# EAGLE design M652A (EAGLE 6.6.0)
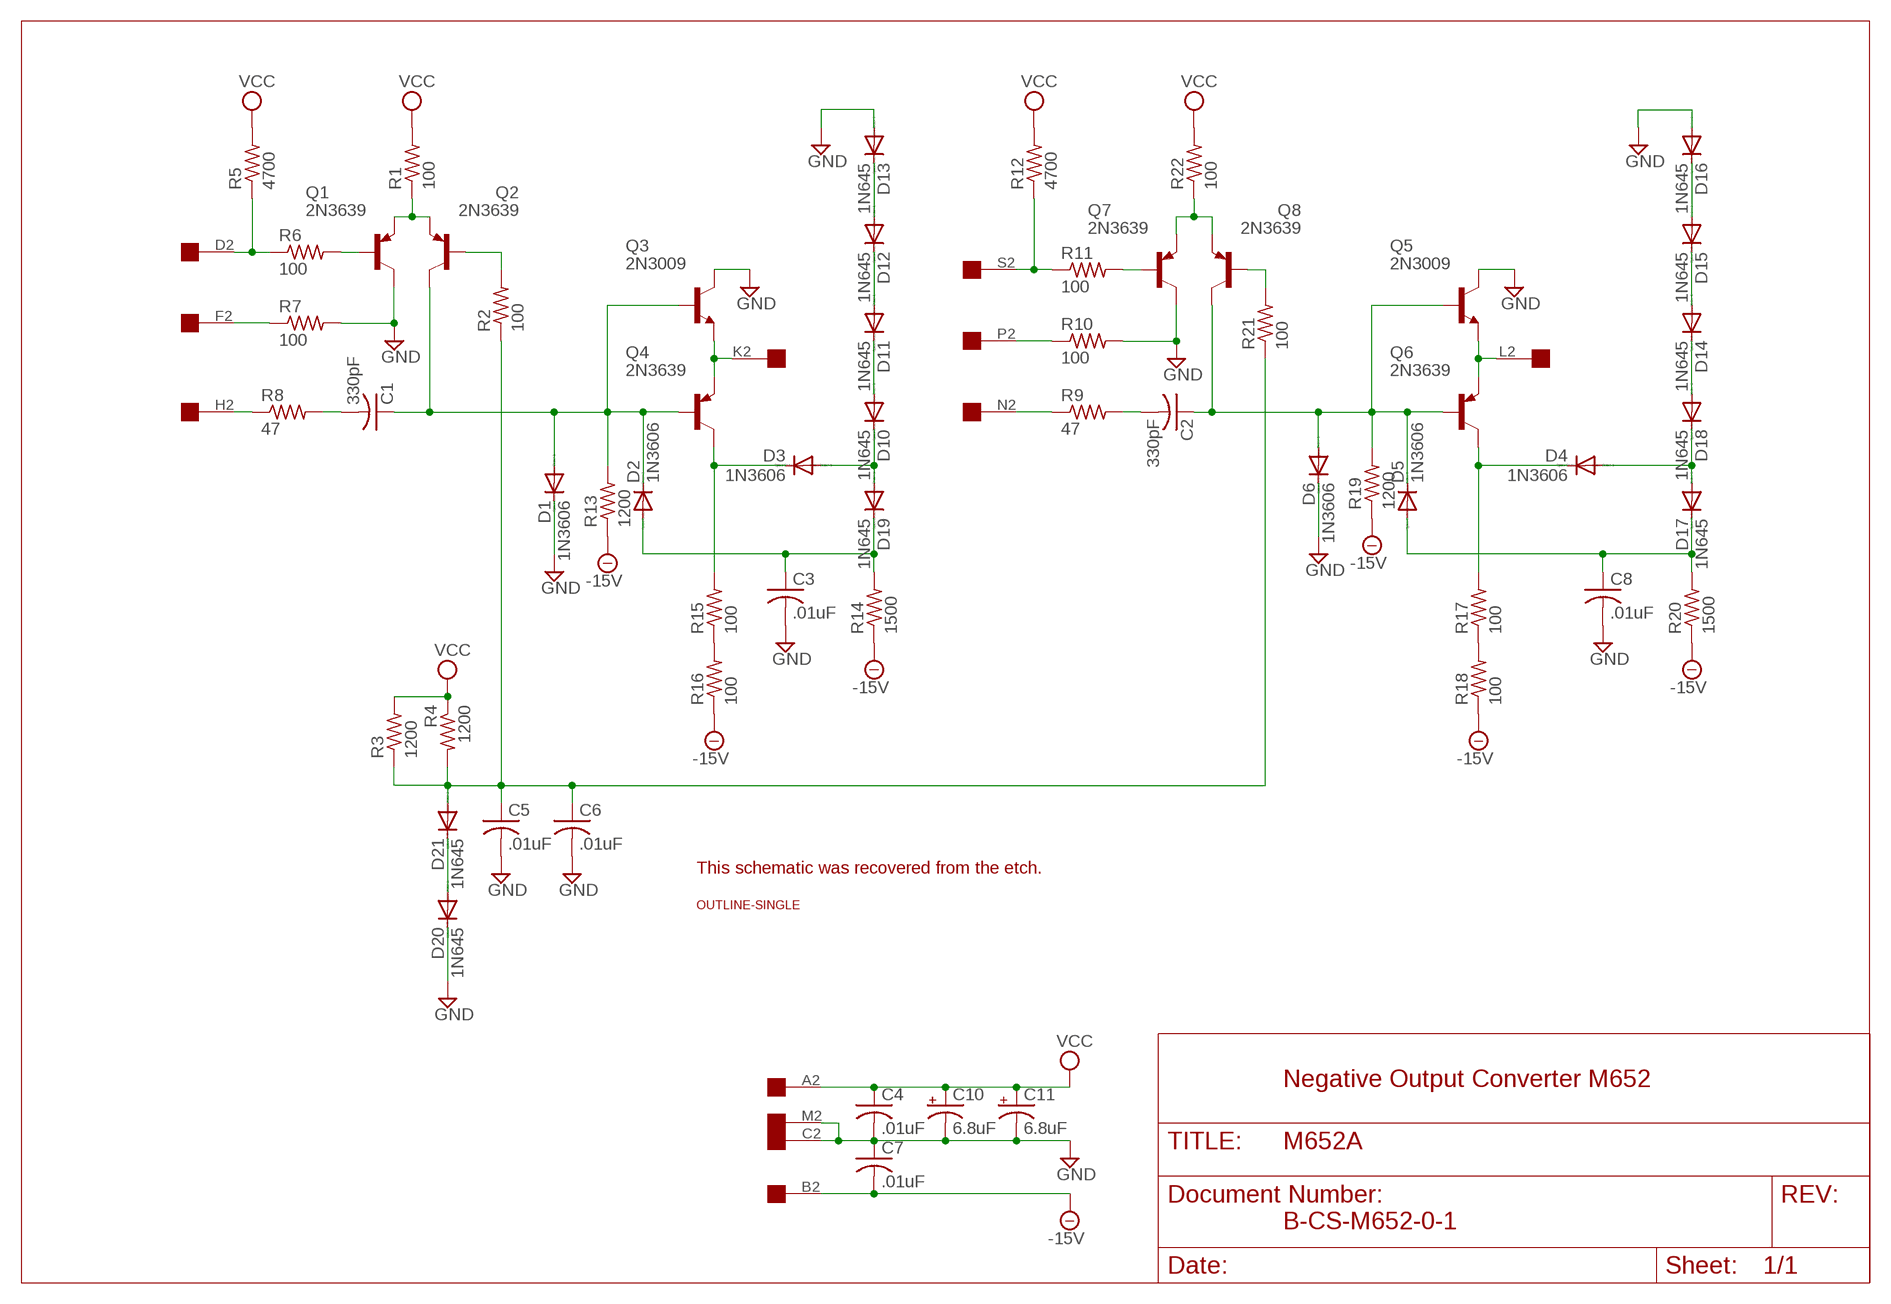
[diagram p0: schematic, sheet 1]

## Parts
C1  330pF  C-US150-054X183  [C150-054X183]
C2  330pF  C-US150-054X183  [C150-054X183]
C3  .01uF  C-US050-025X075  [C050-025X075]
C4  .01uF  C-US050-025X075  [C050-025X075]
C5  .01uF  C-US050-025X075  [C050-025X075]
C6  .01uF  C-US050-025X075  [C050-025X075]
C7  .01uF  C-US050-025X075  [C050-025X075]
C8  .01uF  C-US050-025X075  [C050-025X075]
C10  6.8uF  CPOL-USE12-4AXIAL  [E12-4]
C11  6.8uF  CPOL-USE12-4AXIAL  [E12-4]
D1  1N3606  1N4148DO35-10  [DO35-10]
D2  1N3606  1N4148DO35-10  [DO35-10]
D3  1N3606  1N4148DO35-10  [DO35-10]
D4  1N3606  1N4148DO35-10  [DO35-10]
D5  1N3606  1N4148DO35-10  [DO35-10]
D6  1N3606  1N4148DO35-10  [DO35-10]
D10  1N645  1N4148DO35-10  [DO35-10]
D11  1N645  1N4148DO35-10  [DO35-10]
D12  1N645  1N4148DO35-10  [DO35-10]
D13  1N645  1N4148DO35-10  [DO35-10]
D14  1N645  1N4148DO35-10  [DO35-10]
D15  1N645  1N4148DO35-10  [DO35-10]
D16  1N645  1N4148DO35-10  [DO35-10]
D17  1N645  1N4148DO35-10  [DO35-10]
D18  1N645  1N4148DO35-10  [DO35-10]
D19  1N645  1N4148DO35-10  [DO35-10]
D20  1N645  1N4148DO35-10  [DO35-10]
D21  1N645  1N4148DO35-10  [DO35-10]
Q1  2N3639  2N5415  [TO39]
Q2  2N3639  2N5415  [TO39]
Q3  2N3009  2N2219  [TO5]
Q4  2N3639  2N5415  [TO39]
Q5  2N3009  2N2219  [TO5]
Q6  2N3639  2N5415  [TO39]
Q7  2N3639  2N5415  [TO39]
Q8  2N3639  2N5415  [TO39]
R1  100  R-US_0207/10  [0207/10]
R2  100  R-US_0207/10  [0207/10]
R3  1200  R-US_0207/10  [0207/10]
R4  1200  R-US_0207/10  [0207/10]
R5  4700  R-US_0207/10  [0207/10]
R6  100  R-US_0207/10  [0207/10]
R7  100  R-US_0207/10  [0207/10]
R8  47  R-US_0207/10  [0207/10]
R9  47  R-US_0207/10  [0207/10]
R10  100  R-US_0207/10  [0207/10]
R11  100  R-US_0207/10  [0207/10]
R12  4700  R-US_0207/10  [0207/10]
R13  1200  R-US_0207/10  [0207/10]
R14  1500  R-US_0207/10  [0207/10]
R15  100  R-US_0207/10  [0207/10]
R16  100  R-US_0207/10  [0207/10]
R17  100  R-US_0207/10  [0207/10]
R18  100  R-US_0207/10  [0207/10]
R19  1200  R-US_0207/10  [0207/10]
R20  1500  R-US_0207/10  [0207/10]
R21  100  R-US_0207/10  [0207/10]
R22  100  R-US_0207/10  [0207/10]
U$1  OUTLINE-SINGLE  [SINGLE]
U$3  EDGE-1  [EDGE-CON1]

## Nets
-15V: C7.2 R13.1 R14.1 R16.1 R18.1 R19.1 R20.1 U$3.B2
GND [Supply]: C3.2 C4.2 C5.2 C6.2 C7.1 C8.2 C10.- C11.- D1.C D6.C D13.A D16.A D20.C Q1.3(C) Q3.3(C) Q5.3(C) Q7.3(C) R7.2 R10.2 U$3.C2 U$3.M2
N$1: R5.1 R6.1 U$3.D2
N$2: Q1.2(B) R6.2
N$3: Q1.1(E) Q2.1(E) R1.1
N$4: R7.1 U$3.F2
N$5: R8.1 U$3.H2
N$6: C1.2 R8.2
N$7: R15.1 R16.2
N$8: Q3.1(E) Q4.1(E) U$3.K2
N$9: Q5.1(E) Q6.1(E) U$3.L2
N$10: C2.1 D5.C D6.A Q5.2(B) Q6.2(B) Q8.3(C) R19.2
N$11: C1.1 D1.A D2.C Q2.3(C) Q3.2(B) Q4.2(B) R13.2
N$12: Q7.1(E) Q8.1(E) R22.1
N$13: Q7.2(B) R11.2
N$14: R11.1 R12.1 U$3.S2
N$15: R9.1 U$3.N2
N$16: R10.1 U$3.P2
N$17: C5.1 C6.1 D21.A R2.1 R3.1 R4.2 R21.1
N$18: C2.2 R9.2
N$19: D12.A D13.C
N$20: D15.A D16.C
N$21: D11.A D12.C
N$22: D14.A D15.C
N$23: D10.A D11.C
N$24: D14.C D18.A
N$25: C3.1 D2.A D19.C R14.2
N$26: D3.A D10.C D19.A
N$27: D4.A D17.A D18.C
N$28: C8.1 D5.A D17.C R20.2
N$30: D3.C Q4.3(C) R15.2
N$31: D20.A D21.C
N$32: Q2.2(B) R2.2
N$34: Q8.2(B) R21.2
N$36: R17.1 R18.2
N$37: D4.C Q6.3(C) R17.2
VCC [Supply]: C4.1 C10.+ C11.+ R1.2 R3.2 R4.1 R5.2 R12.2 R22.2 U$3.A2
Unconnected: U$3.E2 U$3.J2 U$3.R2 U$3.T2 U$3.U2 U$3.V2

## Notes on the sheet
- This schematic was recovered from the etch.
- Negative Output Converter M652
- B-CS-M652-0-1

## Library data of the parts
C1-C8 = rcl:C-US: CAPACITOR, American symbol
C10 C11 = dec-con:CPOL-USE12-4AXIAL: 0.5" veresion of an electrolytic
D1-D6 D10-D21 = diode:1N4148: DIODE high speed (Philips)
Q1 Q2 Q4 Q6-Q8 = transistor-pnp:2N5415*: PNP Transistror
Q3 Q5 = transistor-npn:2N2219: NPN Transistor
R1-R22 = rcl:R-US_: RESISTOR, American symbol
U$1 = dec-con:OUTLINE-*: Board outlines for DEC boards.
U$3 = dec-con:EDGE-1: Single-Sided DEC Edge Connector -- (side 2)

## Net classes
1 Supply: width 0.813 mm

## Board
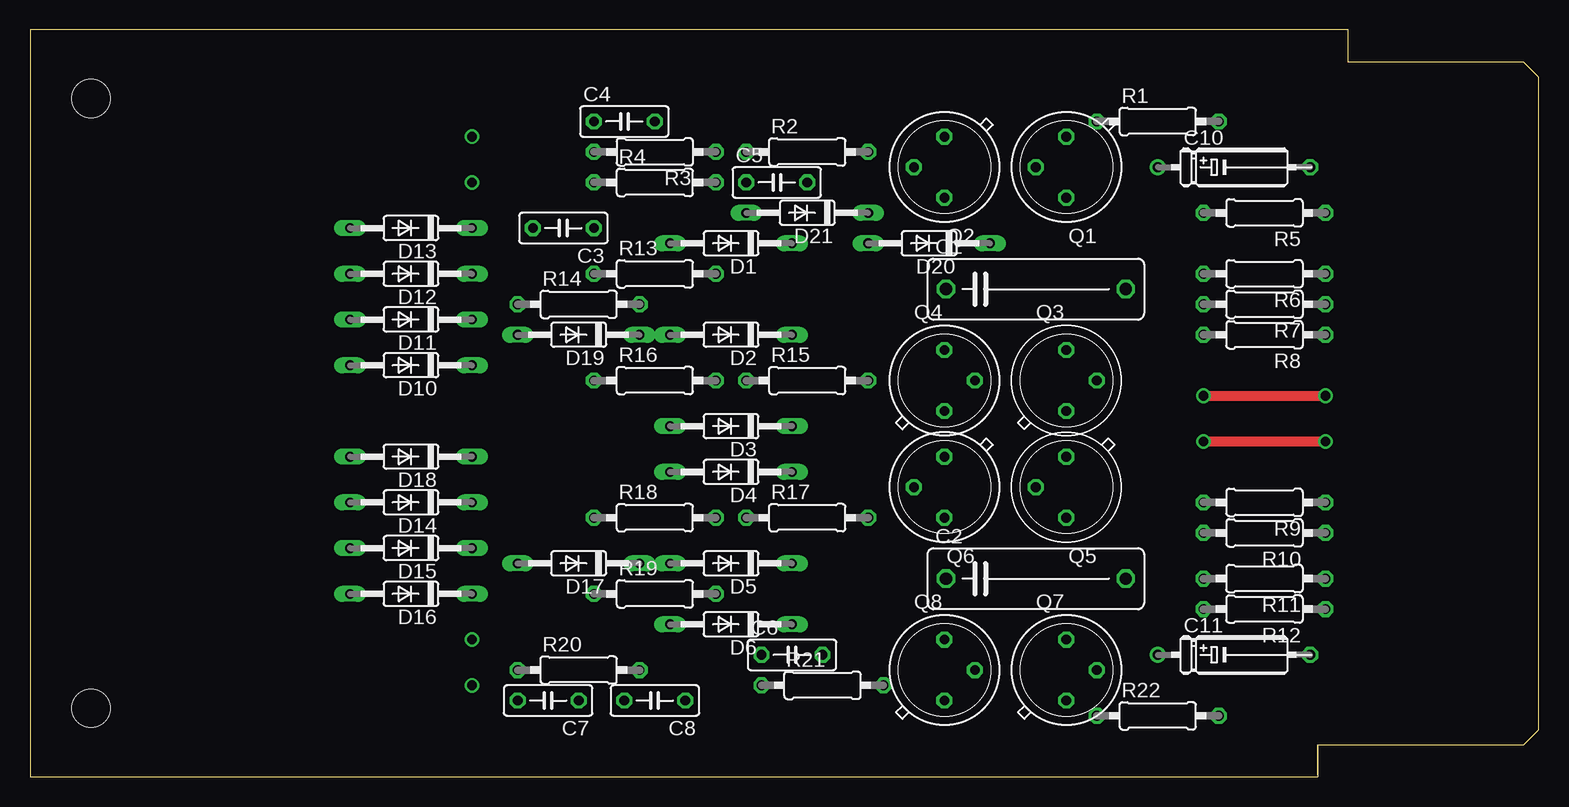
[diagram p1: board, top side]
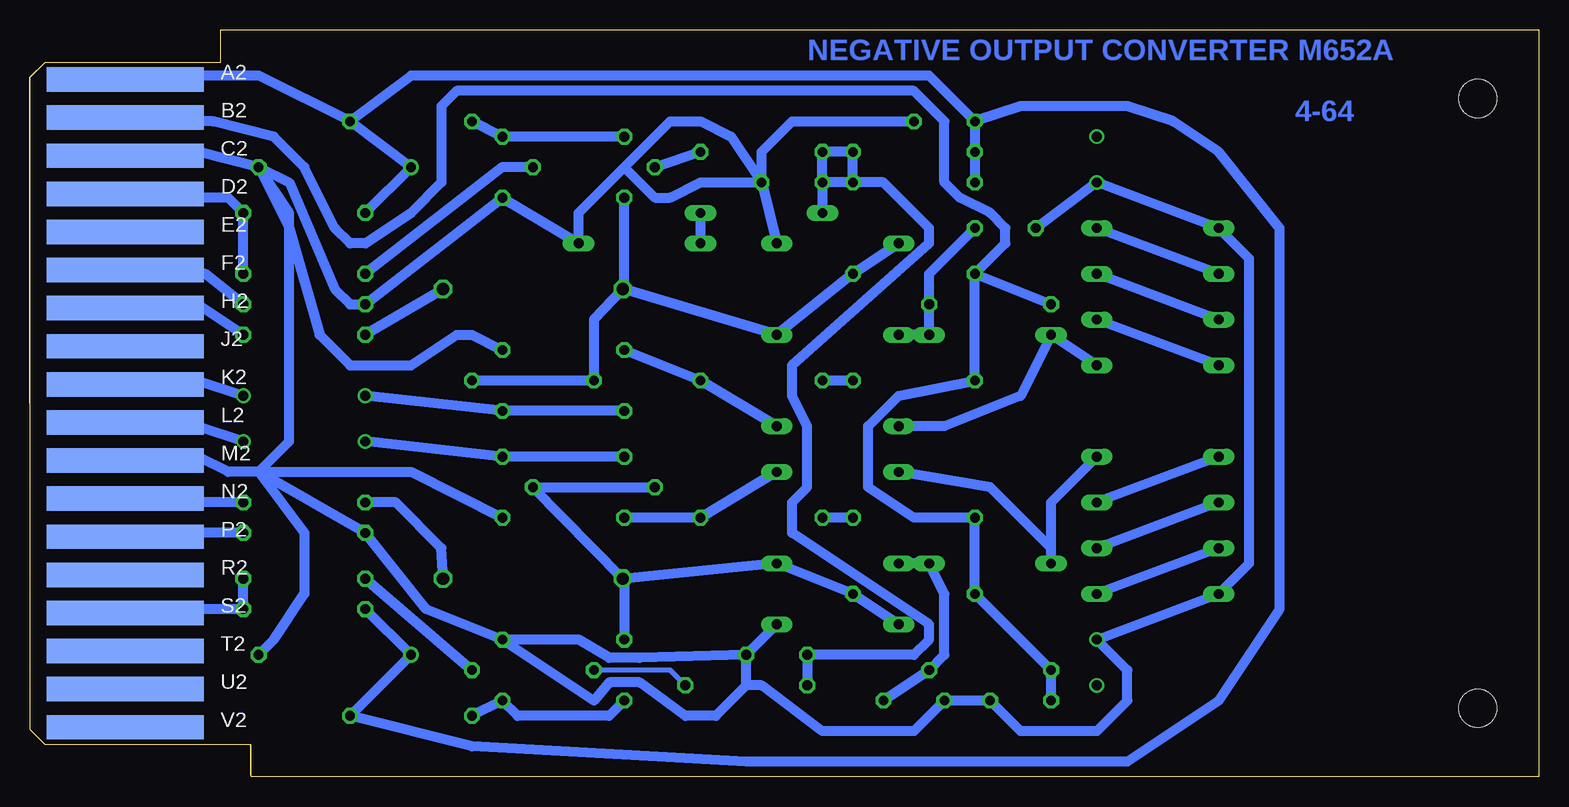
[diagram p2: board, bottom side, seen from below]

Size 125.73 x 62.23 mm. Coordinates in mm from the lower left corner, seen from the top.
Copper layers (1+16): Top 0.035mm / dielectric 1.5mm / Bottom 0.035mm
Design rules "16mils": minimum track width 16mil, minimum drill 32mil, track to track 15mil, track to pad 10mil, pad to pad 10mil, via to via 10mil, smd to smd 10mil, copper to edge 13mil, drill to drill 10mil, minimum pad ring 10mil, minimum via ring 8mil, stop-mask expansion 0mil, vias tented up to drill 0mil, thermal gap 10mil

### Footprints (pad centres in the part's own frame; a part is rotated, then mirrored left to right if it is on the bottom)
C150-054X183 = drill 1.016 octagon: 1 -7.493,0; 2 7.493,0
C050-025X075 = drill 0.813 octagon: 1 -2.54,0; 2 2.54,0
E12-4 = drill 0.813: + -7.62,0 | drill 0.813 octagon: - 5.08,0
DO35-10 = drill 0.813 long: A 5.08,0; C -5.08,0
TO39 = drill 0.813 octagon: 1 0,-2.54; 2 2.54,0; 3 0,2.54
TO5 = drill 0.813 octagon: 1 0,-2.54; 2 2.54,0; 3 0,2.54
0207/10 = drill 0.813 octagon: 1 -5.08,0; 2 5.08,0
SINGLE = hole 3.175: 120.65,56.515; 120.65,5.715
EDGE-CON1 = smd 13.106 x 2.032 bottom: A2 7.938,4.128; B2 7.938,7.303; C2 7.938,10.477; D2 7.938,13.652; E2 7.938,16.828; F2 7.938,20.003; H2 7.938,23.177; J2 7.938,26.352; K2 7.938,29.527; L2 7.938,32.703; M2 7.938,35.877; N2 7.938,39.053; P2 7.938,42.227; R2 7.938,45.403; S2 7.938,48.578; T2 7.938,51.752; U2 7.938,54.928; V2 7.938,58.102

### Placement (x,y rotation side)
C1  83.82,40.64 0 top
C2  83.82,16.51 0 top
C3  44.45,45.72 180 top
C4  49.53,54.61 0 top
C5  62.23,49.53 0 top
C6  63.5,10.16 0 top
C7  43.18,6.35 180 top
C8  52.07,6.35 180 top
C10  101.6,50.8 0 top
C11  101.6,10.16 0 top
D1  58.42,44.45 180 top
D2  58.42,36.83 180 top
D3  58.42,29.21 180 top
D4  58.42,25.4 180 top
D5  58.42,17.78 180 top
D6  58.42,12.7 180 top
D10  31.75,34.29 180 top
D11  31.75,38.1 180 top
D12  31.75,41.91 180 top
D13  31.75,45.72 180 top
D14  31.75,22.86 180 top
D15  31.75,19.05 180 top
D16  31.75,15.24 180 top
D17  45.72,17.78 180 top
D18  31.75,26.67 180 top
D19  45.72,36.83 180 top
D20  74.93,44.45 180 top
D21  64.77,46.99 180 top
Q1  86.36,50.8 180 top
Q2  76.2,50.8 180 top
Q3  86.36,33.02 0 top
Q4  76.2,33.02 0 top
Q5  86.36,24.13 180 top
Q6  76.2,24.13 180 top
Q7  86.36,8.89 0 top
Q8  76.2,8.89 0 top
R1  93.98,54.61 0 top
R2  64.77,52.07 0 top
R3  52.07,52.07 180 top
R4  52.07,49.53 0 top
R5  102.87,46.99 180 top
R6  102.87,41.91 180 top
R7  102.87,39.37 180 top
R8  102.87,36.83 180 top
R9  102.87,22.86 180 top
R10  102.87,20.32 180 top
R11  102.87,16.51 180 top
R12  102.87,13.97 180 top
R13  52.07,41.91 0 top
R14  45.72,39.37 0 top
R15  64.77,33.02 0 top
R16  52.07,33.02 0 top
R17  64.77,21.59 0 top
R18  52.07,21.59 0 top
R19  52.07,15.24 0 top
R20  45.72,8.89 0 top
R21  66.04,7.62 0 top
R22  93.98,5.08 0 top
U$1  125.73,62.23 180 top
U$3  125.73,62.23 180 top

### Tracks (layer width: path | path; a pad name or v marks a point on that pad's centre or on a via)
-15V
  Bottom 0.813: U$3.B2 116.84,54.61 110.49,54.61 105.41,53.34 102.87,50.8 100.33,45.72 99.06,44.45 97.79,44.45 93.98,46.99 91.44,49.53 91.44,55.88 90.17,57.15 52.07,57.15 49.53,54.61 49.53,49.53 48.26,48.26 45.72,46.99 44.45,45.72 44.45,44.45 R13.1 | R13.1 R14.1 | R13.1 R16.1 53.34,31.75 55.88,29.21 55.88,24.13 52.07,21.59 R18.1 R19.1 R20.1 C7.2
GND  (via drill 0.81)
  Bottom 0.813: U$3.C2 116.84,52.07 111.76,52.07 C10.- | C10.- 104.14,49.53 100.33,40.64 99.06,39.37 R7.2 Q1.3 D20.C 80.01,46.99 76.2,50.8 | Q3.3 88.9,36.83 90.17,36.83 93.98,34.29 99.06,34.29 101.6,36.83 104.14,45.72 C10.- | U$3.M2 116.84,26.67 111.76,26.67 109.22,25.4 106.68,25.4 | 106.68,25.4 104.14,27.94 104.14,46.99 C10.- | Q5.3 93.98,25.4 106.68,25.4 | C11.- 105.41,11.43 102.87,15.24 102.87,20.32 106.68,25.4 | C4.2 62.23,54.61 64.77,52.07 C5.2 | C5.2 69.85,49.53 72.39,48.26 73.66,48.26 76.2,50.8 | C5.2 67.31,53.34 69.85,54.61 72.39,54.61 76.2,50.8 | 106.68,25.4 R10.2 92.71,13.97 Q7.3 | C3.2 v36.83,49.53 D13.A 24.13,43.18 24.13,17.78 D16.A v36.83,11.43 34.29,8.89 34.29,6.35 36.83,3.81 43.18,3.81 C7.1 C8.2 52.07,3.81 59.69,3.81 64.77,7.62 66.04,7.62 | Q7.3 78.74,6.35 77.47,7.87 74.93,7.87 71.12,5.08 68.58,5.08 66.04,7.62 | 66.04,7.62 C6.2 | C5.2 D1.C | C6.2 74.93,9.91 77.47,9.91 80.01,11.43 Q7.3 | C6.2 D6.C
N$1
  Bottom 0.813: U$3.D2 116.84,48.26 109.22,48.26 R5.1 R6.1
N$2
  Bottom 0.813: Q1.2 86.36,50.8 R6.2
N$3
  Bottom 0.813: Q2.1 Q1.1 R1.1
N$4
  Bottom 0.813: U$3.F2 116.84,41.91 111.12,41.91 R7.1
N$5
  Bottom 0.813: U$3.H2 116.84,39.37 111.76,39.37 R8.1
N$6
  Bottom 0.813: C1.2 R8.2
N$7
  Bottom 0.813: R16.2 R15.1
N$8  (via drill 0.81)
  Top 0.813: v97.79,31.75 v107.95,31.75
  Bottom 0.813: U$3.K2 116.84,33.02 111.76,33.02 v107.95,31.75 | v97.79,31.75 Q3.1 Q4.1
N$9  (via drill 0.81)
  Top 0.813: v97.79,27.94 v107.95,27.94
  Bottom 0.813: Q6.1 Q5.1 v97.79,27.94 | U$3.L2 116.84,29.21 111.76,29.21 v107.95,27.94
N$10
  Bottom 0.813: Q6.2 Q5.2 C2.1 76.2,16.51 | 76.2,16.51 Q8.3 | 76.2,16.51 D5.C R19.2 D6.A
N$11
  Bottom 0.813: Q3.2 Q4.2 78.74,38.1 C1.1 76.21,40.6 | 76.21,40.6 D2.C R13.2 D1.A | 76.21,40.6 76.2,40.64 Q2.3
N$12
  Bottom 0.813: Q8.1 77.47,5.08 85.09,5.08 Q7.1 R22.1
N$13
  Bottom 0.813: Q7.2 R11.2
N$14
  Bottom 0.813: U$3.S2 116.84,13.97 R12.1 R11.1
N$15
  Bottom 0.813: U$3.N2 116.84,22.86 R9.1
N$16
  Bottom 0.813: U$3.P2 116.84,20.32 R10.1
N$17
  Bottom 0.813: R4.2 R3.1 R2.1 C5.1 | R4.2 C5.1 | C5.1 D21.A | R4.2 54.61,49.53 50.8,45.72 50.8,44.45 62.23,34.29 62.23,31.75 60.96,29.21 60.96,24.13 62.23,22.86 62.23,20.32 50.8,12.7 50.8,11.43 52.07,10.16 C6.1 R21.1
N$18
  Bottom 0.813: C2.2 91.44,19.05 95.25,22.86 R9.2
N$19
  Bottom 0.813: D12.A D13.C
N$20
  Bottom 0.813: D15.A D16.C
N$21
  Bottom 0.813: D11.A D12.C
N$22
  Bottom 0.813: D14.A D15.C
N$23
  Bottom 0.813: D10.A D11.C
N$24
  Bottom 0.813: D18.A D14.C
N$25
  Bottom 0.813: D2.A D19.C R14.2 50.8,41.91 C3.1
N$26
  Bottom 0.813: D10.C D19.A 43.18,31.75 49.53,29.21 D3.A
N$27
  Bottom 0.813: D18.C 40.64,22.86 40.64,19.05 | D17.A 40.64,19.05 | D4.A 45.72,24.13 40.64,19.05
N$28
  Bottom 0.813: C8.1 R20.2 49.53,10.16 49.53,15.24 D17.C D5.A
N$29  (via drill 0.81)
  other vias: 36.83,53.34
N$30
  Bottom 0.813: D3.C R15.2 Q4.3
N$31
  Bottom 0.813: D20.A D21.C
N$32
  Bottom 0.813: R2.2 Q2.2
N$33  (via drill 0.81)
  other vias: 36.83,7.62
N$34
  Bottom 0.406: R21.2 72.39,8.89 Q8.2
N$36
  Bottom 0.813: R18.2 R17.1
N$37
  Bottom 0.813: Q6.3 R17.2 D4.C
VCC
  Bottom 0.813: U$3.A2 117.22,58.04 116.84,58.42 106.68,58.42 R1.2 | R1.2 93.98,58.42 50.8,58.42 C4.1 | R1.2 C10.+ R5.2 | R12.2 C11.+ R22.2 88.9,2.54 66.04,1.27 34.29,1.27 26.67,6.35 21.59,13.97 21.59,45.72 26.67,52.07 30.48,54.61 34.29,55.88 43.18,55.88 C4.1 | C4.1 R3.2 R4.1

### Text on the board
Bottom: NEGATIVE OUTPUT CONVERTER M652A | 4-64